# Altium schematic sheet PowerSupply.SchDoc
size A
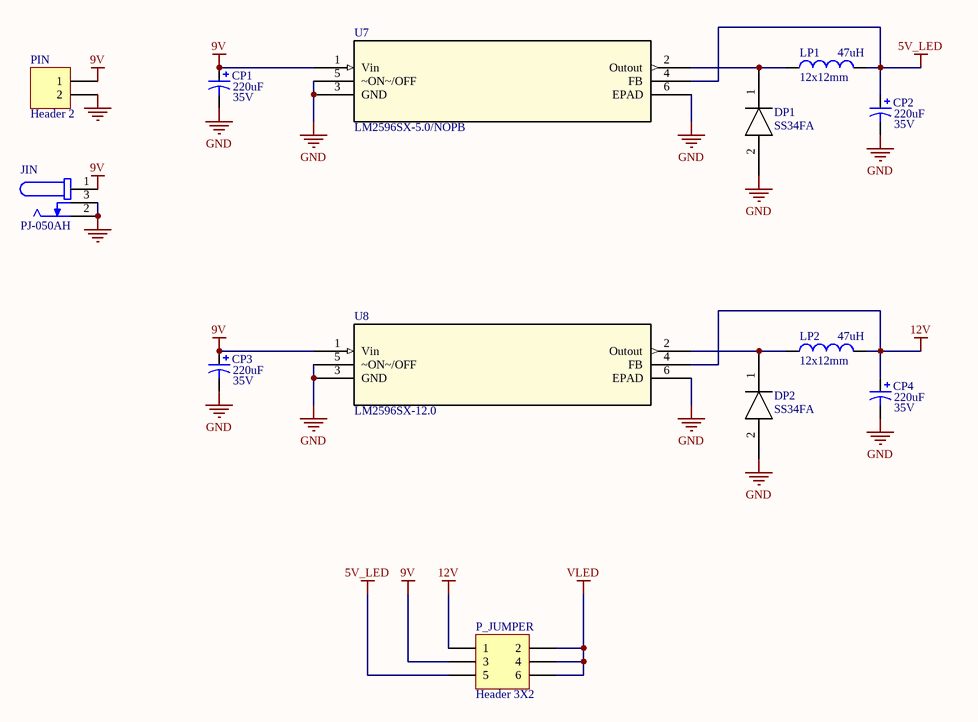
[diagram p0: PowerSupply.SchDoc]

## Parts
CP1  value 220uF  Voltage: 35V  [Cap10x10]  (hidden comment: Cap Pol)
CP2  value 220uF  Voltage: 35V  [Cap10x10]  (hidden comment: Cap Pol)
CP3  value 220uF  Voltage: 35V  [Cap10x10]  (hidden comment: Cap Pol)
CP4  value 220uF  Voltage: 35V  [Cap10x10]  (hidden comment: Cap Pol)
DP1  SS34FA  [SOD_34FA_ONS]
DP2  SS34FA  [SOD_34FA_ONS]
JIN  PJ-050AH  [CUI_PJ-050AH]
LP1  12x12mm  value 47uH  [12x12mmInductor]
LP2  12x12mm  value 47uH  [12x12mmInductor]
P_JUMPER  Header 3X2  [HDR2X3]
PIN  Header 2  [5.08mmScrew]
U7  LM2596SX-5.0/NOPB  [TS5B]
U8  LM2596SX-12.0  [TS5B]

## Nets
5V_LED: CP2.1 LP1.2 P_JUMPER.5 U7.4(FB)
9V: CP1.1 CP3.1 JIN.1 P_JUMPER.3 PIN.1 U7.1(Vin) U8.1(Vin)
12V: CP4.1 LP2.2 P_JUMPER.1 U8.4(FB)
GND: CP1.2 CP2.2 CP3.2 CP4.2 DP1.2 DP2.2 JIN.2 JIN.3 PIN.2 U7.3(GND) U7.5(~ON~/OFF) U7.6(EPAD) U8.3(GND) U8.5(~ON~/OFF) U8.6(EPAD)
VLED: P_JUMPER.2 P_JUMPER.4 P_JUMPER.6
NetDP1_1: DP1.1 LP1.1 U7.2(Outout)
NetDP2_1: DP2.1 LP2.1 U8.2(Outout)

## Library data of the parts
CP1-CP4 = Cap Pol1: CAP ALUM 220UF 20% 35V SMD; Manufacturer 1: Vishay BCcomponents; Manufacturer Part Number 1: MAL214699004E3; Ripple Current: 900mA; Impedance: 97mR; Polarity: Polar; Leakage Current: 77uA; Life (Hours): 2000Hour; Lead Diameter: 1mm; ComponentLink1URL: https://datasheet.ciiva.com/98/e-pw-98277.pdf?src-supplier=Digi-Key; ComponentLink1Description: https://datasheet.ciiva.com/98/e-pw-98277.pdf?src-supplier=Digi-Key; ComponentLink2URL: https://datasheet.ciiva.com/11684/e-pw-11684827.pdf?src-supplier=Avnet; ComponentLink2Description: https://datasheet.ciiva.com/11684/e-pw-11684827.pdf?src-supplier=Avnet; ComponentLink3URL: https://datasheet.ciiva.com/30522/getdatasheetpartid-740118-30522112.pdf?src-supplier=Verical; ComponentLink3Description: https://datasheet.ciiva.com/30522/getdatasheetpartid-740118-30522112.pdf?src-supplier=Verical; ComponentLink4URL: https://datasheet.ciiva.com/11781/0900766b80fa3a43-11781959.pdf?src-supplier=RSComponents; ComponentLink4Description: https://datasheet.ciiva.com/11781/0900766b80fa3a43-11781959.pdf?src-supplier=RSComponents; ComponentLink5URL: https://datasheet.ciiva.com/17525/e-ur-17525415.pdf?src-supplier=Avnet+Europe; ComponentLink5Description: https://datasheet.ciiva.com/17525/e-ur-17525415.pdf?src-supplier=Avnet+Europe; ComponentLink6URL: https://datasheet.ciiva.com/6300/e-ur-6300136.pdf?src-supplier=Digi-Key; ComponentLink6Description: https://datasheet.ciiva.com/6300/e-ur-6300136.pdf?src-supplier=Digi-Key; ComponentLink7URL: https://datasheet.ciiva.com/6300/e-ur-6300140.pdf?src-supplier=Digi-Key; ComponentLink7Description: https://datasheet.ciiva.com/6300/e-ur-6300140.pdf?src-supplier=Digi-Key; ComponentLink8URL: https://datasheet.ciiva.com/7781/e-pm-7781625.pdf?src-supplier=Element14; ComponentLink8Description: https://datasheet.ciiva.com/7781/e-pm-7781625.pdf?src-supplier=Element14; Supplier 1: Digi-Key; Supplier Part Number 1: 4427PHCT-ND; Stock 1: 2631; Pricing 1: 1=2.42000, 10=1.95700, 50=1.70800, 100=1.49460 (USD); RoHS: Yes; Mount: Surface Mount; Case/Package: Radial; Min Operating Temperature: -55°C; Max Operating Temperature: 125°C; Capacitance: 220uF; Tolerance: 20%; Package Quantity: 250; Packaging: Tape and Reel; Termination: SMD/SMT; Diameter: 10mm; Height: 12mm; Lead Pitch: 3.5mm; Width: 10mm; Height - Seated (Max): 0.472inch; Radiation Hardening: No; Lead Free: Lead Free; ComponentLink9URL: https://datasheet.ciiva.com/99/146cti-99688.pdf?src-supplier=Digi-Key; ComponentLink9Description: https://datasheet.ciiva.com/99/146cti-99688.pdf?src-supplier=Digi-Key; ComponentLink10URL: https://datasheet.ciiva.com/99/146cti-99689.pdf?src-supplier=Digi-Key; ComponentLink10Description: https://datasheet.ciiva.com/99/146cti-99689.pdf?src-supplier=Digi-Key; ComponentLink11URL: https://datasheet.ciiva.com/11777/0900766b81003e87-11777120.pdf?src-supplier=RSComponents; ComponentLink11Description: https://datasheet.ciiva.com/11777/0900766b81003e87-11777120.pdf?src-supplier=RSComponents; ComponentLink12URL: https://datasheet.ciiva.com/99/146cti-99690.pdf?src-supplier=Digi-Key; ComponentLink12Description: https://datasheet.ciiva.com/99/146cti-99690.pdf?src-supplier=Digi-Key; ComponentLink13URL: https://datasheet.ciiva.com/17508/146cti-17508093.pdf?src-supplier=Avnet+Europe; ComponentLink13Description: https://datasheet.ciiva.com/17508/146cti-17508093.pdf?src-supplier=Avnet+Europe; ComponentLink14URL: https://datasheet.ciiva.com/5360/146cti-247382-5360191.pdf?src-supplier=Mouser; ComponentLink14Description: https://datasheet.ciiva.com/5360/146cti-247382-5360191.pdf?src-supplier=Mouser; ComponentLink15URL: https://datasheet.ciiva.com/11697/146cti-11697674.pdf?src-supplier=Avnet; ComponentLink15Description: https://datasheet.ciiva.com/11697/146cti-11697674.pdf?src-supplier=Avnet
DP1 DP2 = SS34FA: DIODE SCHOTTKY 40V 3A SOD123FA; Manufacturer 1: ON Semiconductor / Fairchild; SourceLibrary: ON_Semiconductor_2020-03-06; Vendor: ON Semiconductor; Element Configuration: Single; Max Forward Surge Current (Ifsm): 80A; Datasheet: https://datasheet.octopart.com/SS34FA-ON-Semiconductor-datasheet-137362515.pdf; Manufacturer_Part_Number: SS34FA; Copyright: Copyright (C) 2018 Accelerated Designs. All rights reserved; RefDes: RefDes; Type: DEV; Supplier 1: Digi-Key; Manufacturer Part Number 1: SS34FA; Stock 1: 11283; Pricing 1: 1=0.35000, 10=0.28200, 25=0.25800, 100=0.16200, 500=0.15000, 1000=0.10200 (USD); RoHS: Yes; Mount: Surface Mount; Case/Package: SOD; Weight: 0.019g; Packaging: Tape and Reel; Average Rectified Current: 3A; Max Reverse Voltage (DC): 40V; Max Repetitive Reverse Voltage (Vrrm): 40V; ComponentLink1URL: http://www.mouser.com/ds/2/149/SS34FA-1012641.pdf?src-supplier=Mouser; ComponentLink1Description: http://www.mouser.com/ds/2/149/SS34FA-1012641.pdf?src-supplier=Mouser; ComponentLink2URL: http://www.farnell.com/datasheets/2552647.pdf?src-supplier=Farnell; ComponentLink2Description: http://www.farnell.com/datasheets/2552647.pdf?src-supplier=Farnell; ComponentLink3URL: http://www.farnell.com/datasheets/2552647.pdf?src-supplier=Newark; ComponentLink3Description: http://www.farnell.com/datasheets/2552647.pdf?src-supplier=Newark; ComponentLink4URL: https://www.fairchildsemi.com/datasheets/SS/SS34FA.pdf?src-supplier=Digi-Key; ComponentLink4Description: https://www.fairchildsemi.com/datasheets/SS/SS34FA.pdf?src-supplier=Digi-Key; Supplier Part Number 1: SS34FACT-ND
JIN = PJ-050AH: 2.0 x 6.0 mm, 5.0 A, Horizontal, Through Hole, Pick-n-Place Top, Dc Power Jack Connector; Manufacturer 1: CUI; MF: CUI Devices; Voltage Rating: 24V; Gender: Male; Shielding: Unshielded; Current Rating: 5A; Number of Conductors: 2; Insulation Resistance: 100MR; Package: None; Value: *; Price: None; MP: PJ-050AH; SnapEDA_Link: https://www.snapeda.com/parts/PJ-050AH/CUI%20Devices/view-part/281220/?ref=snap; Availability: Unavailable; Supplier 1: Digi-Key; Manufacturer Part Number 1: PJ-050AH; Stock 1: 5226; Pricing 1: 1=0.78000, 10=0.68900, 25=0.64800, 50=0.62100, 100=0.59400, 250=0.54000, 500=0.48600, 1000=0.43200, 2500=0.39150 (USD); RoHS: Yes; Mount: Through Hole; Housing Material: Thermoplastic; Contact Plating: Nickel; Color: Black; Contact Material: Copper; Housing Color: Black; Min Operating Temperature: -25°C; Max Operating Temperature: 85°C; Package Quantity: 500; Termination: Solder; Connector Type: Jack; Orientation: Horizontal; Contact Gender: Male; Lead Free: Lead Free; Flammability Rating: UL94 V-0; ComponentLink1URL: http://www.mouser.com/ds/2/670/PJ-050AH-524150.pdf?src-supplier=Mouser; ComponentLink1Description: http://www.mouser.com/ds/2/670/PJ-050AH-524150.pdf?src-supplier=Mouser; ComponentLink2URL: https://www.cui.com/product/resource/digikeypdf/pj-050ah.pdf?src-supplier=Digi-Key; ComponentLink2Description: https://www.cui.com/product/resource/digikeypdf/pj-050ah.pdf?src-supplier=Digi-Key; Supplier Part Number 1: CP-050AH-ND
LP1 LP2 = Inductor: FIXED IND 47UH 3.8A 60 MOHM SMD; Manufacturer 1: Wurth Electronics; Manufacturer Part Number 1: 7447709470; Core Material: Ferrite; Saturation Current: 4.5A; Tolerance: 20%; Shielding: Shielded; Self Resonant Frequency: 6.5MHz; Resistance: 60mR; Test Frequency: 1kHz; ComponentLink1URL: http://productfinder.pulseeng.com/products/datasheets/P747.pdf?src-supplier=Digi-Key; ComponentLink1Description: http://productfinder.pulseeng.com/products/datasheets/P747.pdf?src-supplier=Digi-Key; ComponentLink2URL: http://productfinder.pulseeng.com/products/datasheets/P747.pdf?src-supplier=Avnet; ComponentLink2Description: http://productfinder.pulseeng.com/products/datasheets/P747.pdf?src-supplier=Avnet; Supplier 1: Digi-Key; Supplier Part Number 1: 732-1246-1-ND; Stock 1: 6664; Pricing 1: 1=2.41000, 10=2.20000, 50=2.07000, 100=1.94000 (USD); RoHS: Yes; Mount: Surface Mount; Case/Package: Nonstandard; Number of Pins: 2; Weight: 0.01lb; Case Code (Metric): 3225; Case Code (Imperial): 1210; Min Operating Temperature: -40°C; Max Operating Temperature: 125°C; Package Quantity: 250; Packaging: Cut Tape; Termination: SMD/SMT; Current Rating: 3.8A; Inductance: 47uH; Inductance Tolerance: 20%; Composition: Wirewound; DC Resistance (DCR): 60mR; Max DC Current: 3.8A; RMS Current (Irms): 3.8A; Series Resistance: 60mR; Length: 12mm; Height: 10mm; Width: 12mm; Height - Seated (Max): 0.394inch; Lead Pitch: 7mm; Depth: 12mm; REACH SVHC: Unknown; Lead Free: Lead Free; ComponentLink3URL: https://datasheet.ciiva.com/1061/7447709470-1061024.pdf?src-supplier=Digi-Key; ComponentLink3Description: https://datasheet.ciiva.com/1061/7447709470-1061024.pdf?src-supplier=Digi-Key; ComponentLink4URL: https://datasheet.ciiva.com/30489/0900766b81281ba0-30489750.pdf?src-supplier=RSComponents; ComponentLink4Description: https://datasheet.ciiva.com/30489/0900766b81281ba0-30489750.pdf?src-supplier=RSComponents; ComponentLink5URL: https://datasheet.ciiva.com/6699/7447709470-6699847.pdf?src-supplier=Digi-Key; ComponentLink5Description: https://datasheet.ciiva.com/6699/7447709470-6699847.pdf?src-supplier=Digi-Key; ComponentLink6URL: https://datasheet.ciiva.com/4954/7447709470-59270-4954744.pdf?src-supplier=Mouser; ComponentLink6Description: https://datasheet.ciiva.com/4954/7447709470-59270-4954744.pdf?src-supplier=Mouser; ComponentLink7URL: https://datasheet.ciiva.com/1061/7447709470-1061025.pdf?src-supplier=Digi-Key; ComponentLink7Description: https://datasheet.ciiva.com/1061/7447709470-1061025.pdf?src-supplier=Digi-Key; ComponentLink8URL: https://datasheet.ciiva.com/7754/1736317-7754662.pdf?src-supplier=Element14; ComponentLink8Description: https://datasheet.ciiva.com/7754/1736317-7754662.pdf?src-supplier=Element14; ComponentLink9URL: https://datasheet.ciiva.com/22709/1736317-22709767.pdf?src-supplier=Element14; ComponentLink9Description: https://datasheet.ciiva.com/22709/1736317-22709767.pdf?src-supplier=Element14; ComponentLink10URL: https://datasheet.ciiva.com/48690/001087736-da-01-ml-we-pd-smd-speicherdrossel-74477094-de-en-48690519.pdf?src-supplier=Conrad; ComponentLink10Description: https://datasheet.ciiva.com/48690/001087736-da-01-ml-we-pd-smd-speicherdrossel-74477094-de-en-48690519.pdf?src-supplier=Conrad
P_JUMPER = Header 3X2: CONN HEADER VERT 6POS 2.54MM; Manufacturer 1: Sullins; Manufacturer Part Number 1: PREC003DFAN-RC; Number of Positions: 6; Connector Type: Male Pin; Pitch: 0.1inch; LatestRevisionDate: 17-Jul-2002; LatestRevisionNote: Re-released for DXP Platform.; Publisher: Altium Limited; Supplier 1: Digi-Key; Supplier Part Number 1: S2212EC-03-ND; Stock 1: 963; Pricing 1: 1=0.16000, 10=0.15100, 25=0.12920, 50=0.11280, 100=0.10480, 250=0.09272, 500=0.08870 (USD); RoHS: Yes; Mount: Through Hole; Color: Black; Contact Plating: Tin; Package Quantity: 1; Number of Rows: 2; Packaging: Bulk; Termination: Solder; Contact Type: Male Pin; Row Spacing: 0.1inch; Contact Mating Length: 0.318inch; RoHS Compliant: Yes; ComponentLink1URL: https://datasheet.ciiva.com/741/xrxczzzdxxn-rc-11636-b-741002.pdf?src-supplier=Digi-Key; ComponentLink1Description: https://datasheet.ciiva.com/741/xrxczzzdxxn-rc-11636-b-741002.pdf?src-supplier=Digi-Key
PIN = Header 2: TERMINAL BLOCK, SCREW TYPE, 5.08; Manufacturer 1: CUI; Manufacturer Part Number 1: TB007-508-02BE; LatestRevisionDate: 17-Jul-2002; LatestRevisionNote: Re-released for DXP Platform.; Publisher: Altium Limited; Supplier 1: Digi-Key; Supplier Part Number 1: 102-6203-ND; Stock 1: 3593; Pricing 1: 1=0.73000, 10=0.39800, 25=0.29760, 50=0.26520, 100=0.26000, 250=0.22880, 500=0.20800, 1000=0.18720, 5000=0.14040 (USD); RoHS: No
U7 = LM2596SX-5.0/NOP: Buck Switching Regulator IC Positive Fixed 5V 1 Output 3A TO-263-6, D²Pak (5 Leads + Tab), TO-263BA; Manufacturer 1: TI National Semiconductor; Vendor: Texas Instruments; Built_By: EMA_UL_Team; Number of Outputs: 1; Switching Frequency: 173kHz; Quiescent Current: 5mA; Min Input Voltage: 4.5V; Max Input Voltage: 40V; Efficiency: 80%; Synchronous Rectifier: No; Manufacturer_Part_Number: LM2596SX-5.0/NOPB; Copyright: Copyright (C) 2018 Accelerated Designs. All rights reserved; RefDes: RefDes; Type: DEV; Value: Value; Supplier 1: Digi-Key; Manufacturer Part Number 1: LM2596SX-5.0/NOPB; Stock 1: 3918; Pricing 1: 1=4.91000, 10=4.41300, 25=4.17160, 100=3.42990, 250=3.07764 (USD); RoHS: Yes; Mount: Surface Mount; Case/Package: TO-263-5; Number of Pins: 5; Weight: 0.01lb; Contact Plating: Tin; Min Operating Temperature: -40°C; Max Operating Temperature: 125°C; Output Voltage: 5V; Output Current: 3A; Packaging: Tape and Reel; Max Output Current: 3A; Package Quantity: 500; Nominal Output Voltage: 5V; Min Output Voltage: 5V; Operating Supply Voltage: 40V; Output Type: Fixed; Output Configuration: Positive; Length: 1inch; Height: 0.5inch; Width: 0.75inch; Radiation Hardening: No; REACH SVHC: No SVHC; Lead Free: Contains Lead; ComponentLink1URL: https://datasheet.ciiva.com/41457/001013815-da-01-en-ic-reg-bu-lm2596sx-5-0-nopb-to-263-5-tid-41457760.pdf?src-supplier=Conrad; ComponentLink1Description: https://datasheet.ciiva.com/41457/001013815-da-01-en-ic-reg-bu-lm2596sx-5-0-nopb-to-263-5-tid-41457760.pdf?src-supplier=Conrad; ComponentLink2URL: https://datasheet.ciiva.com/6603/lm2596-6603286.pdf?src-supplier=Digi-Key; ComponentLink2Description: https://datasheet.ciiva.com/6603/lm2596-6603286.pdf?src-supplier=Digi-Key; ComponentLink3URL: https://datasheet.ciiva.com/22669/1874590-22669465.pdf?src-supplier=Element14; ComponentLink3Description: https://datasheet.ciiva.com/22669/1874590-22669465.pdf?src-supplier=Element14; ComponentLink4URL: https://datasheet.ciiva.com/46382/1874590-46382490.pdf?src-supplier=Element14; ComponentLink4Description: https://datasheet.ciiva.com/46382/1874590-46382490.pdf?src-supplier=Element14; Supplier Part Number 1: LM2596SX-5.0/NOPBCT-ND
U8 = LM2596SX-5.0/NOP: Buck Switching Regulator IC Positive Fixed 12V 1 Output 3A TO-263-6, D²Pak (5 Leads + Tab), TO-263BA; Manufacturer 1: TI National Semiconductor; Manufacturer Part Number 1: LM2596SX-12/NOPB; Number of Outputs: 1; Min Input Voltage: 4.5V; Max Input Voltage: 40V; Switching Frequency: 173kHz; Efficiency: 90%; Synchronous Rectifier: No; Quiescent Current: 5mA; ComponentLink1URL: https://datasheet.ciiva.com/41457/001013815-da-01-en-ic-reg-bu-lm2596sx-5-0-nopb-to-263-5-tid-41457760.pdf?src-supplier=Conrad; ComponentLink1Description: https://datasheet.ciiva.com/41457/001013815-da-01-en-ic-reg-bu-lm2596sx-5-0-nopb-to-263-5-tid-41457760.pdf?src-supplier=Conrad; ComponentLink2URL: https://datasheet.ciiva.com/6603/lm2596-6603286.pdf?src-supplier=Digi-Key; ComponentLink2Description: https://datasheet.ciiva.com/6603/lm2596-6603286.pdf?src-supplier=Digi-Key; ComponentLink3URL: https://datasheet.ciiva.com/22669/1874590-22669465.pdf?src-supplier=Element14; ComponentLink3Description: https://datasheet.ciiva.com/22669/1874590-22669465.pdf?src-supplier=Element14; ComponentLink4URL: https://datasheet.ciiva.com/46382/1874590-46382490.pdf?src-supplier=Element14; ComponentLink4Description: https://datasheet.ciiva.com/46382/1874590-46382490.pdf?src-supplier=Element14; Supplier 1: Digi-Key; Supplier Part Number 1: LM2596SX-12/NOPBCT-ND; Stock 1: 651; Pricing 1: 1=4.77000, 10=4.28400, 25=4.05000, 100=3.33000, 250=2.98800 (USD); RoHS: Yes; Mount: Surface Mount; Case/Package: TO-263; Number of Pins: 5; Min Operating Temperature: -40°C; Max Operating Temperature: 125°C; Nominal Output Voltage: 12V; Packaging: Tape and Reel; Output Voltage: 12V; Max Output Current: 3A; Output Current: 3A; Package Quantity: 500; Min Supply Voltage: 4.5V; Min Output Voltage: 12V; Operating Supply Voltage: 40V; Output Type: Fixed; Output Configuration: Positive; Radiation Hardening: No; REACH SVHC: No SVHC; Lead Free: Contains Lead; ComponentLink5URL: https://datasheet.ciiva.com/15112/getdatasheetpartid-55558-15112635.pdf?src-supplier=Verical; ComponentLink5Description: https://datasheet.ciiva.com/15112/getdatasheetpartid-55558-15112635.pdf?src-supplier=Verical; ComponentLink6URL: https://datasheet.ciiva.com/41457/001013811-da-01-en-ic-reg-buc-lm2596sx-12-nopb-to-263-5-tid-41457755.pdf?src-supplier=Conrad; ComponentLink6Description: https://datasheet.ciiva.com/41457/001013811-da-01-en-ic-reg-buc-lm2596sx-12-nopb-to-263-5-tid-41457755.pdf?src-supplier=Conrad; ComponentLink7URL: https://datasheet.ciiva.com/3220/lm2596-3220759.pdf?src-supplier=Avnet; ComponentLink7Description: https://datasheet.ciiva.com/3220/lm2596-3220759.pdf?src-supplier=Avnet; ComponentLink8URL: https://datasheet.ciiva.com/6603/lm2596-6603272.pdf?src-supplier=Digi-Key; ComponentLink8Description: https://datasheet.ciiva.com/6603/lm2596-6603272.pdf?src-supplier=Digi-Key; ComponentLink9URL: https://datasheet.ciiva.com/6603/lm2596-6603274.pdf?src-supplier=Digi-Key; ComponentLink9Description: https://datasheet.ciiva.com/6603/lm2596-6603274.pdf?src-supplier=Digi-Key; ComponentLink10URL: https://datasheet.ciiva.com/6603/lm2596-6603275.pdf?src-supplier=Digi-Key; ComponentLink10Description: https://datasheet.ciiva.com/6603/lm2596-6603275.pdf?src-supplier=Digi-Key; ComponentLink11URL: https://datasheet.ciiva.com/14303/lm2596-14303583.pdf?src-supplier=Avnet; ComponentLink11Description: https://datasheet.ciiva.com/14303/lm2596-14303583.pdf?src-supplier=Avnet